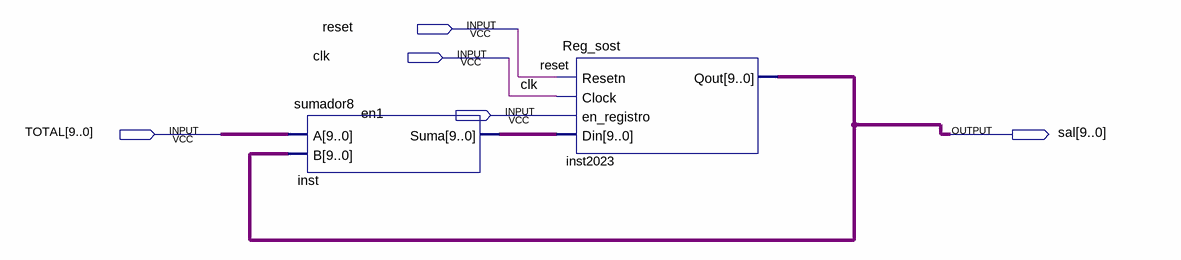
[diagram p0: schematic sheet]
// Quartus schematic Block1.bdf as structural Verilog: 2 symbols, 5 pins
module Block1 (
  input  reset,
  input  clk,
  input  en1,
  input  [9:0] TOTAL,
  output [9:0] sal
);

  wire [9:0] inst_suma;

  sumador8 inst (.A(TOTAL), .B(sal), .Suma(inst_suma));
  Reg_sost inst2023 (.Resetn(reset), .Clock(clk), .en_registro(en1), .Din(inst_suma), .Qout(sal));
endmodule
